# EAGLE design AAA_PowerSupply (EAGLE 9.6.2)
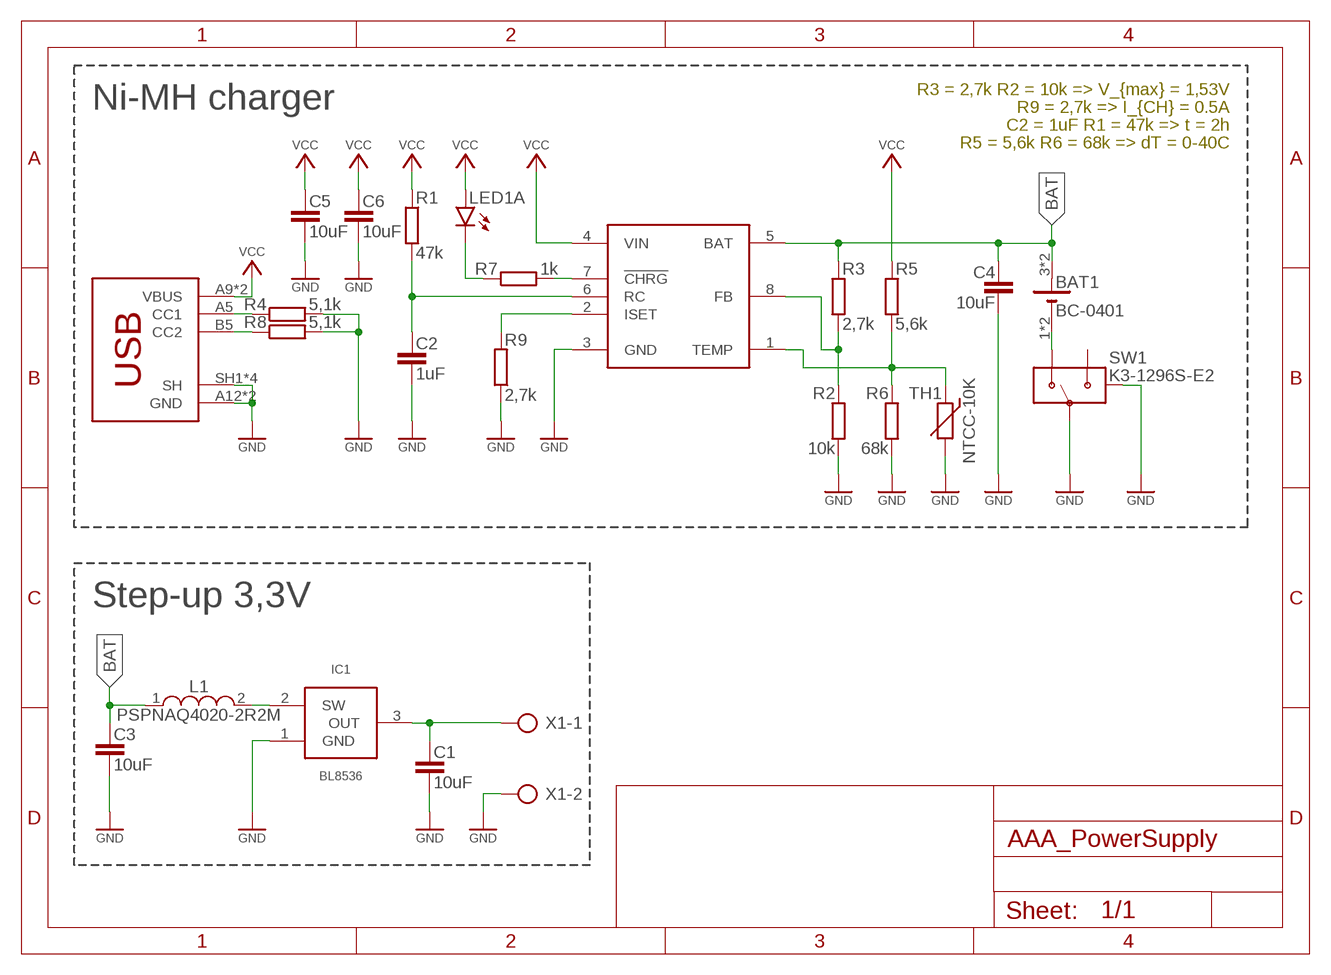
[diagram p0: schematic, sheet 1]

## Parts
BAT1  BC-0401  [BC-0401]
C1  10uF  C-EUC0805  [C0805]
C2  1uF  C-EUC0805  [C0805]
C3  10uF  C-EUC0805  [C0805]
C4  10uF  C-EUC0805  [C0805]
C5  10uF  C-EUC0805  [C0805]
C6  10uF  C-EUC0805  [C0805]
IC1  BL8536  [SOT23]
IC2  CN3085  [SOP8_THERMAL]
L1  PSPNAQ4020-2R2M  INDUCTOR-4X4  [L-4X4]
LED1  LSG-T676  [WL-SFCW-0603]
R1  47k  R-EU_R0805  [R0805]
R2  10k  R-EU_R0805  [R0805]
R3  2,7k  R-EU_R0805  [R0805]
R4  5,1k  R-EU_R0805  [R0805]
R5  5,6k  R-EU_R0805  [R0805]
R6  68k  R-EU_R0805  [R0805]
R7  1k  R-EU_R0805  [R0805]
R8  5,1k  R-EU_R0805  [R0805]
R9  2,7k  R-EU_R0805  [R0805]
SW1  K3-1296S-E2  [K3-1296S-E2]
TH1  NTCC-10K  THERMISTOR-2,5  [RS-2,5]
X1  AK500/2  [AK500/2]
X2  HC-TYPE-C-6P-01QT  [HC-TYPE-C-6P-01QT]

## Nets
BAT: BAT1.3(+) BAT1.4(+) C3.1 C4.1 IC2.5(BAT) L1.1 R3.1
GND: C1.2 C2.2 C3.2 C4.2 C5.2 C6.2 IC1.1(GND) IC2.3(GND) R2.2 R4.2 R6.2 R8.2 R9.1 SW1.P SW1.SH1(SH) SW1.SH2(SH) SW1.SH3(SH) SW1.SH4(SH) TH1.2 X1.2 X2.A12(GND) X2.B12(GND) X2.SH1(SH) X2.SH2(SH) X2.SH3(SH) X2.SH4(SH)
N$2: IC2.7(!CHRG) R7.2
N$3: LED1.P$1(A:C) R7.1
N$4: C2.1 IC2.6(RC) R1.2
N$5: IC2.2(ISET) R9.2
N$6: C1.1 IC1.3(OUT) X1.1
N$8: IC1.2(SW) L1.2
N$9: IC2.8(FB) R2.1 R3.2
N$12: IC2.1(TEMP) R5.2 R6.1 TH1.1
N$17: BAT1.1(-) BAT1.2(-) SW1.O
N$18: R4.1 X2.A5(CC1)
N$19: R8.1 X2.B5(CC2)
VCC: C5.1 C6.1 IC2.4(VIN) LED1.P$2(A:A) R1.1 R5.1 X2.A9(VBUS) X2.B9(VBUS)
Unconnected: LED1.P$3(B:C) LED1.P$4(B:A) SW1.S

## Notes on the sheet
- Ni-MH charger | R3 = 2,7k R2 = 10k => V_{max} = 1,53V
- R9 = 2,7k => I_{CH} = 0.5A
- C2 = 1uF R1 = 47k => t = 2h
- R5 = 5,6k R6 = 68k => dT = 0-40C
- Step-up 3,3V

## Library data of the parts
BAT1 = custom_jatsekku:BC-0401
C1-C6 = rcl:C-EU: CAPACITOR, European symbol; SPICEPREFIX: C
IC1 = custom_jatsekku:BL8536
IC2 = custom_jatsekku:CN3085
L1 = dp_devices.v6:INDUCTOR: Inductor
LED1 = custom_jatsekku:LSG-T676: LSG T676 Hyper Multi TOPLED ® Hyper-Bright LED Source: http://docs-europe.electrocomponents.com/webdocs/08c3/0900766b808c36ca.pdf
R1-R9 = rcl:R-EU_: RESISTOR, European symbol; SPICEPREFIX: R
SW1 = custom_jatsekku:K3-1296S-E2
TH1 = varistor:THERMISTOR: THERMISTOR
X1 = con-ptr500:AK500/2: CONNECTOR; OC_FARNELL: unknown; OC_NEWARK: unknown
X2 = custom_jatsekku:HC-TYPE-C-6P-01QT

## Board
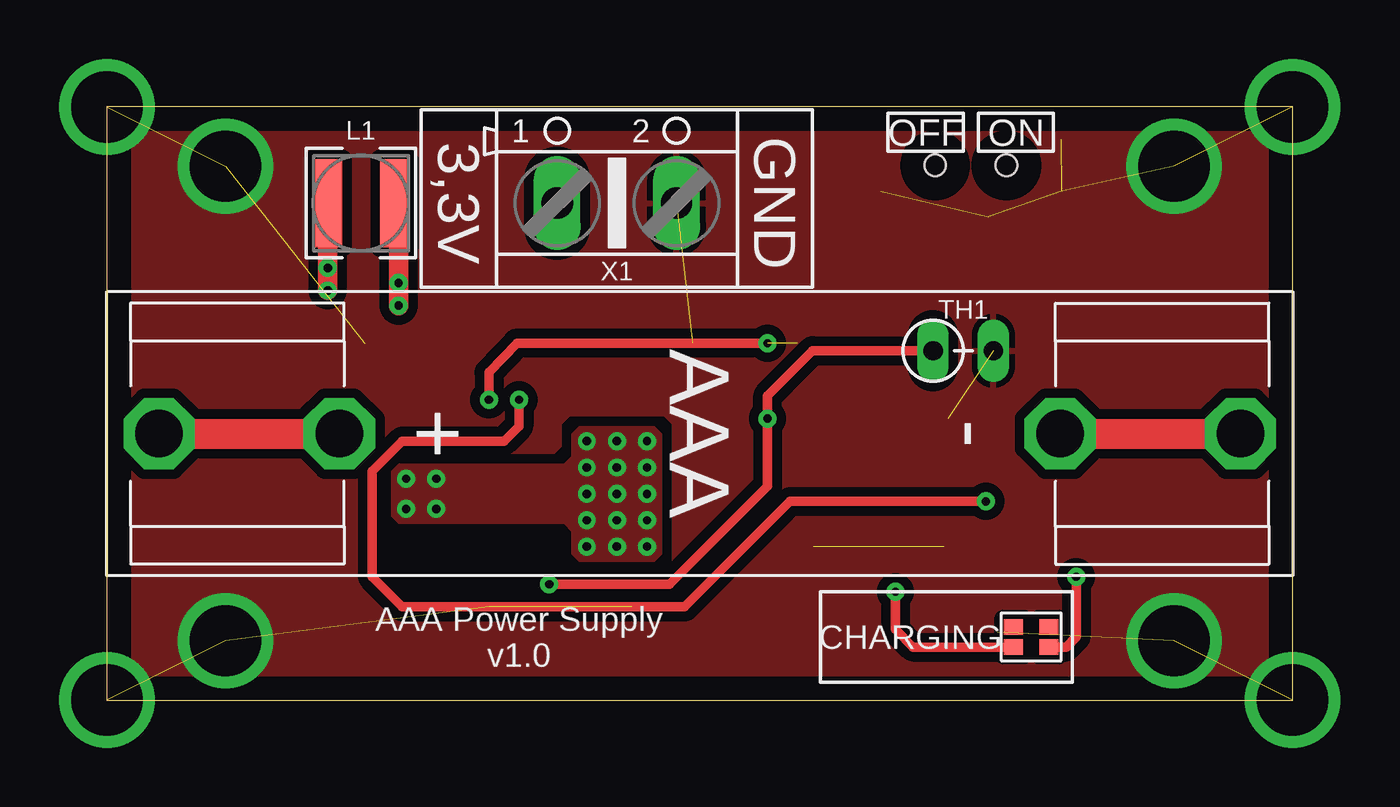
[diagram p1: board, top side]
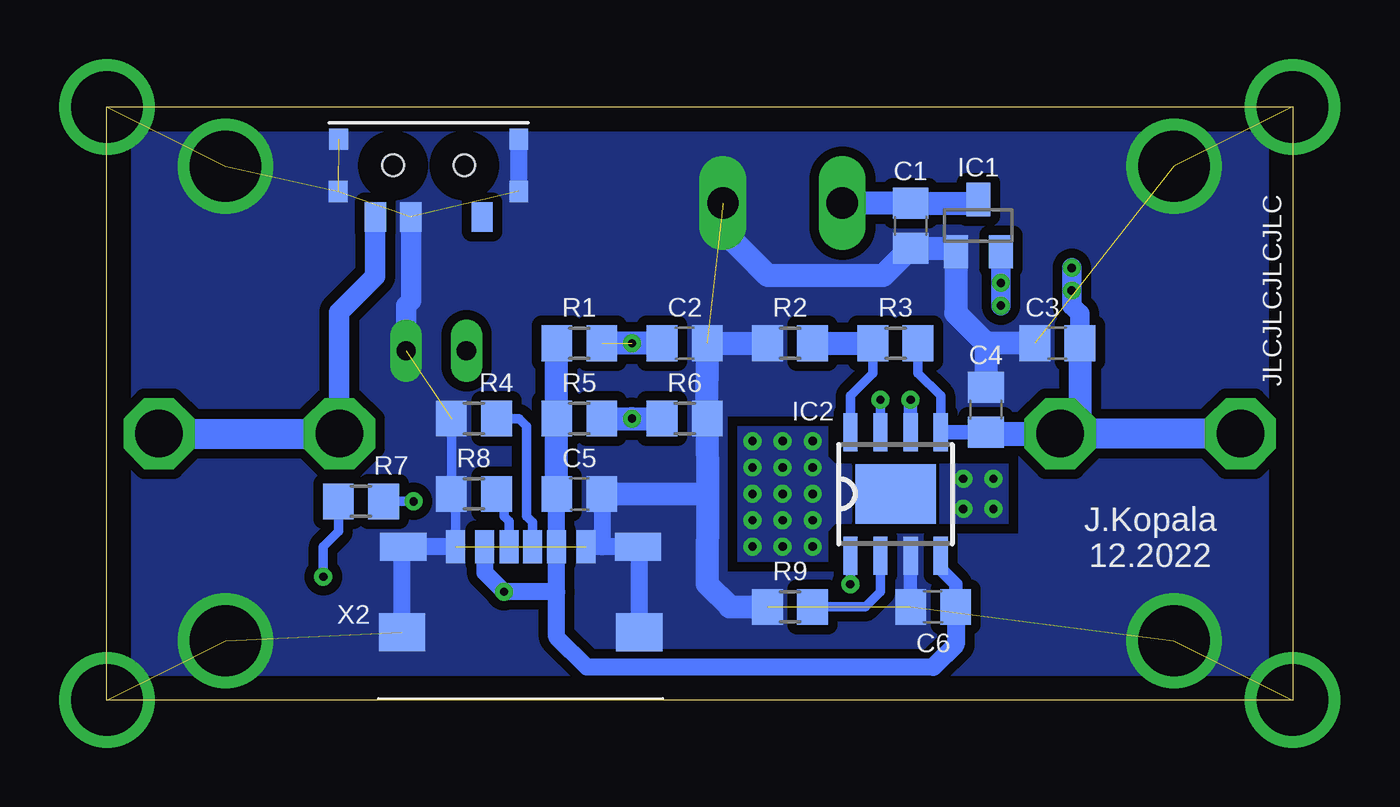
[diagram p2: board, bottom side, seen from below]

Size 50 x 25 mm. Coordinates in mm from the lower left corner, seen from the top.
Outline: 0,0 50,0 50,25 0,25 0,0
Copper layers (1*16): Top 0.035mm / dielectric 1.5mm / Bottom 0.035mm
Design rules "default": minimum track width 6mil, minimum drill 0.35mm, track to track 6mil, track to pad 6mil, pad to pad 6mil, via to via 6mil, smd to smd 6mil, copper to edge 40mil, drill to drill 6mil, minimum pad ring 10mil, minimum via ring 8mil, stop-mask expansion 4mil, vias tented up to drill 0mil, thermal gap 10mil

### Footprints (pad centres in the part's own frame; a part is rotated, then mirrored left to right if it is on the bottom)
BC-0401 = drill 2 octagon: 1 -22.8,0; 2 -15.2,0; 3 15.2,0; 4 22.8,0
C0805 = smd 1.3 x 1.5: 1 -0.95,0; 2 0.95,0
SOT23 = smd 1 x 1.4: 1 -0.95,-1.1; 2 0.95,-1.1; 3 0,1.1
SOP8_THERMAL = smd 0.6 x 1.6: 1 -1.905,-2.6; 2 -0.635,-2.6; 3 0.635,-2.6; 4 1.905,-2.6; 5 1.905,2.6; 6 0.635,2.6; 7 -0.635,2.6; 8 -1.905,2.6 | smd 3.4 x 2.5: THERMAL 0,0
L-4X4 = smd 1.2 x 3.7: 1 -1.4,0; 2 1.4,0
WL-SFCW-0603 = smd 0.8 x 0.65: P$1 -0.75,0.425; P$2 0.75,0.425; P$3 -0.75,-0.425; P$4 0.75,-0.425
R0805 = smd 1.3 x 1.5: 1 -0.95,0; 2 0.95,0
K3-1296S-E2 = smd 0.9 x 1.25: O -2.25,-2.175; P -0.75,-2.175; S 2.25,-2.175 | smd 0.8 x 0.9: SH1 -3.8,1.1; SH2 3.8,1.1; SH3 -3.82,-1.1; SH4 3.8,-1.1 | hole 0.9: -1.5,0; 1.5,0
RS-2,5 = drill 0.813 long: 1 -1.27,0; 2 1.27,0
AK500/2 = drill 1.321 long: 1 -2.515,0; 2 2.515,0
HC-TYPE-C-6P-01QT = smd 0.8 x 1.4: A5 0.5,2.85; A9 -1.52,2.85; A12 -2.75,2.85; B5 -0.5,2.85; B9 1.52,2.85; B12 2.75,2.85 | smd 1.95 x 1.2: SH1 -4.95,2.85; SH3 4.95,2.85 | smd 1.95 x 1.6: SH2 -5,-0.75; SH4 5,-0.75

### Placement (x,y rotation side)
BAT1  25,11.23 180 top
C1  16.11,20 270 bottom
C2  25.64,15.04 0 bottom
C3  9.92,15.04 180 bottom
C4  12.94,12.24 90 bottom
C5  30.08,8.69 0 bottom
C6  15.16,3.93 180 bottom
IC1  13.25,20 0 bottom
IC2  16.74,8.69 0 bottom
L1  10.71,20.95 0 top
LED1  38.97,2.66 180 top
R1  30.08,15.04 0 bottom
R2  21.19,15.04 180 bottom
R3  16.74,15.04 180 bottom
R4  34.52,11.87 180 bottom
R5  30.08,11.87 0 bottom
R6  25.64,11.87 0 bottom
R7  39.29,8.37 0 bottom
R8  34.52,8.69 180 bottom
R9  21.19,3.93 0 bottom
SW1  36.43,22.54 0 bottom
TH1  36.11,14.72 0 top
X1  21.51,20.95 0 top
X2  32.55,3.61 0 bottom

### Tracks (layer width: path | path; a pad name or v marks a point on that pad's centre or on a via)
BAT  (via drill 0.35)
  Top 0.813: L1.1 v9.31,18.21 v9.31,17.26
  Top 1.27: BAT1.4 BAT1.3
  Bottom 0.406: IC2.5 14.84,12.82 15.79,13.77 R3.1
  Bottom 0.61: IC2.5 C4.1
  Bottom 0.813: C3.1 8.97,16.28 9.31,16.63 v9.31,17.26 v9.31,18.21
  Bottom 0.965: 12.84,11.2 C4.1 12.88,11.23 | 8.81,14.88 C3.1 8.97,12.06 BAT1.3
  Bottom 1.016: 12.88,11.23 BAT1.3 | 4.24,11.36 4.36,11.23
  Bottom 1.27: BAT1.4 4.36,11.23 BAT1.3
GND  (via drill 3)  (15 unrouted)
  Bottom 0.406: R4.2 R8.2 35.3,8.52 X2.A12
  Bottom 0.508: R6.2
  Bottom 0.559: IC2.3 C6.2
  Bottom 0.711: C5.2 29.13,6.46 | X2.SH4 27.55,6.41 X2.SH3 29.13,6.46 | X2.SH2 37.55,6.41 X2.SH1 X2.A12 | 29.13,6.46 X2.B12 | SW1.SH2 SW1.SH4
  Bottom 0.864: SW1.P 37.18,16.83 37.38,16.63 TH1.2
  Bottom 0.965: R2.2 C2.2 24.68,15.04 R6.2 24.68,8.69 | 24.68,8.69 24.68,4.88 23.73,3.93 R9.1 | C5.2 24.68,8.69 | C3.2 12.94,15.04 | 12.94,15.04 C4.2 | 12.94,15.04 14.2,16.31 IC1.1 14.35,19.05 C1.2 17.26,17.9 22.14,17.9 24.02,19.78 X1.2
  other vias: 5,2.5 5,22.5 45,2.5 45,22.5 0,0 0,25 50,0 50,25
  pour Bottom (isolate 0.406, rank 2, no thermals): 1,1 1,24 49,24 49,1
  pour Top (isolate 0.406, rank 2): 1,1 1,24 49,24 49,1
N$2  (via drill 0.35)
  Top 0.406: v17.38,12.66 17.38,11.55 16.74,10.91 12.46,10.91 11.19,9.64 11.19,5.2 12.46,3.93 24.36,3.93 28.81,8.37 v37.06,8.37
  Bottom 0.406: IC2.7 v17.38,12.66 | R7.2 v37.06,8.37
N$3  (via drill 0.35)
  Top 0.406: LED1.P$1 40.45,2.23 40.88,2.66 v40.88,5.2
  Bottom 0.406: v40.88,5.2 40.88,6.47 40.24,7.11 R7.1
N$4  (via drill 0.35)  (1 unrouted)
  Top 0.406: v27.86,15.04 17.29,15.04 16.11,13.81 v16.11,12.66
  Bottom 0.559: IC2.6 v16.11,12.66
  Bottom 0.965: R1.2 C2.1
N$5
  Bottom 0.406: IC2.2 17.38,4.56 18.02,3.93 R9.2
N$6
  Bottom 0.965: IC1.3 13.4,20.95 C1.1 X1.1
N$8  (via drill 0.35)
  Top 0.711: 12.3,20.76 L1.2
  Top 0.813: v12.3,16.63 v12.3,17.58 12.3,20.76
  Bottom 0.813: IC1.2 v12.3,17.58 v12.3,16.63
N$9
  Bottom 0.406: IC2.8 18.65,12.82 17.7,13.77 R3.2
  Bottom 0.965: R2.1 R3.2
N$12  (via drill 0.35)
  Top 0.406: v18.65,4.88 23.73,4.88 27.86,9.01 v27.86,11.87 27.86,12.82 29.76,14.72 TH1.1
  Bottom 0.406: IC2.1 v18.65,4.88
  Bottom 0.965: R5.2 v27.86,11.87 R6.1
N$17
  Top 1.27: BAT1.2 BAT1.1
  Bottom 0.864: BAT1.2 40.2,16.35 38.68,17.87 SW1.O
  Bottom 1.27: BAT1.1 BAT1.2
N$18
  Bottom 0.406: X2.A5 32.05,7.49 32.3,7.74 32.3,11.55 32.62,11.87 R4.1
N$19
  Bottom 0.406: R8.1 33.26,8.37 33.26,7.74 33.05,7.53 X2.B5
THERMAL  (via drill 0.35)
  other vias: 22.78,10.91 20.24,10.91 21.51,10.91 22.78,8.69 21.51,8.69 20.24,8.69 20.24,6.47 21.51,6.47 22.78,6.47 20.24,9.8 21.51,9.8 22.78,9.8 22.78,7.58 21.51,7.58 20.24,7.58 12.62,9.32 12.62,8.05 13.89,9.32 13.89,8.05
  pour Bottom: 11.98,7.42 19.29,7.42 19.6,7.1 19.6,5.83 23.41,5.83 23.41,11.55 19.6,11.55 19.6,10.28 19.29,9.96 11.98,9.96
  pour Top: 19.29,9.96 19.6,10.28 19.6,7.1 19.29,7.42
  pour Top: 11.98,9.64 12.3,9.96 19.29,9.96 19.6,10.28 19.6,11.23 19.92,11.55 23.09,11.55 23.41,11.23 23.41,6.15 23.09,5.83 19.92,5.83 19.6,6.15 19.6,7.1 19.29,7.42 12.3,7.42 11.98,7.74
VCC  (via drill 0.35)
  Top 0.406: LED1.P$2 34,2.23 33.26,2.97 v33.26,4.56
  Bottom 0.559: IC2.4 14.84,5.51 14.21,4.88 C6.1
  Bottom 0.711: C5.1 X2.B9 31.03,4.56 | 15.15,1.4 15.16,1.39 29.76,1.39 31.03,2.65 31.03,4.56 | X2.A9 34.07,5.38 v33.26,4.56 31.03,4.56
  Bottom 0.762: C6.1 14.21,2.34 15.15,1.4
  Bottom 0.965: C5.1 R5.1 R1.1

### Text on the board
tPlace: OFF | ON | 3,3V | GND | AAA Power Supply / v1.0 | CHARGING
bPlace: JLCJLCJLCJLC | J.Kopala / 12.2022